# EAGLE design Decoder (EAGLE 9.6.2)
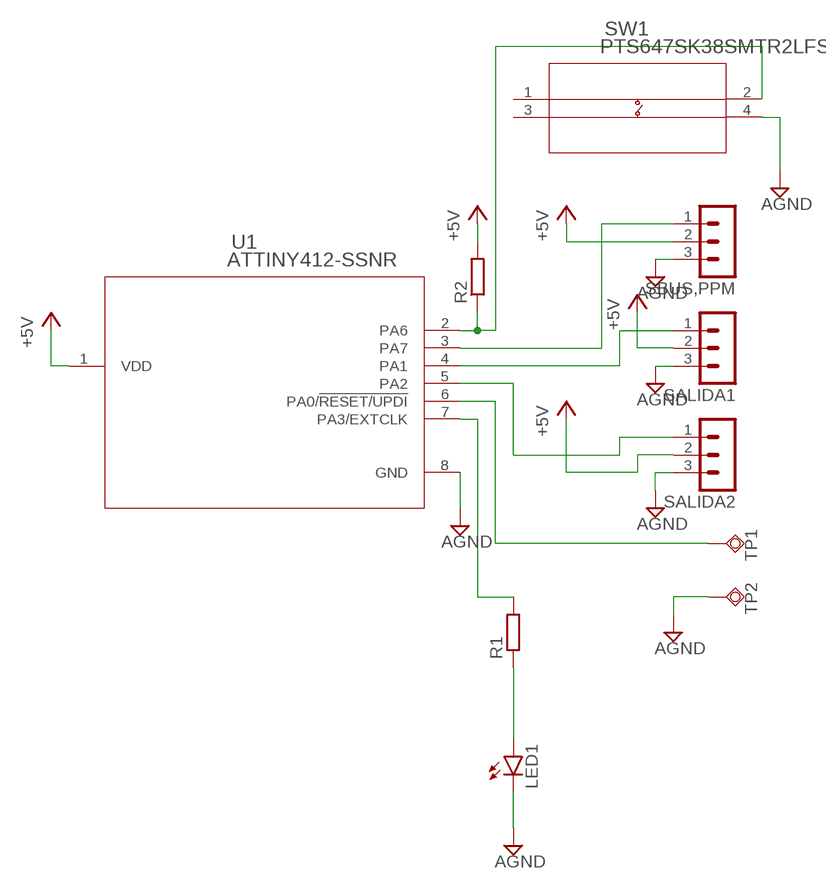
[diagram p0: schematic, sheet 1]

## Parts
LED1  LEDCHIPLED_0603  [CHIPLED_0603]
R1  R-EU_R0805  [R0805]
R2  R-EU_R0805  [R0805]
SALIDA1  MA03-1  [MA03-1]
SALIDA2  MA03-1  [MA03-1]
SBUS,PPM  MA03-1  [MA03-1]
SW1  PTS647SK38SMTR2LFS  [PTS647SK38SMTR2LFS_CNK]
TP1  TPSQTP13R  [TP13R]
TP2  TPSQTP13R  [TP13R]
U1  ATTINY412-SSNR  [SOIC8_SA_SST_MCH]

## Nets
+5V: R2.2 SALIDA1.2 SALIDA2.2 SBUS,PPM.2 U1.1(VDD)
AGND: LED1.C SALIDA1.3 SALIDA2.3 SBUS,PPM.3 SW1.4 TP2.TP U1.8(GND)
N$1: TP1.TP U1.6(PA0/!RESET/UPDI)
N$2: SBUS,PPM.1 U1.3(PA7)
N$3: SALIDA1.1 U1.4(PA1)
N$4: SALIDA2.1 U1.5(PA2)
N$5: R1.2 U1.7(PA3/EXTCLK)
N$6: R2.1 SW1.2 U1.2(PA6)
N$7: LED1.A R1.1
Unconnected: SW1.1 SW1.3

## Library data of the parts
LED1 = led:LED: LED OSRAM: - CHIPLED LG R971, LG N971, LY N971, LG Q971, LY Q971, LO R971, LY R971 LH N974, LH R974 LS Q976, LO Q976, LY Q976 LO Q996 - Hyper CHIPLED LW Q18S LB Q993, LB Q99A, LB R99A - SideLED LS A670, LO A670, LY A670, LG A670, LP A670 LB A673, LV A673, LT A673, LW A673 LH A674 LY A675 LS A676, LA A676, LO A676, LY A676, LW A676 LS A679, LY A679, LG A679 - Hyper Micro SIDELED® LS Y876, LA Y876, LO Y876, LY Y876 LT Y87S - SmartLED LW L88C, LW L88S LB L89C, LB L89S, LG L890 LS L89K, LO L89K, LY L89K LS L896, LA L896, LO L896, LY L896 - TOPLED LS T670, LO T670, LY T670, LG T670, LP T670 LSG T670, LSP T670, LSY T670, LOP T670, LYG T670 LG T671, LOG T671, LSG T671 LB T673, LV T673, LT T673, LW T673 LH T674 LS T676, LA T676, LO T676, LY T676, LB T676, LH T676, LSB T676, LW T676 LB T67C, LV T67C, LT T67C, LS T67K, LO T67K, LY T67K, LW E67C LS E67B, LA E67B, LO E67B, LY E67B, LB E67C, LV E67C, LT E67C LW T67C LS T679, LY T679, LG T679 LS T770, LO T770, LY T770, LG T770, LP T770 LB T773, LV T773, LT T773, LW T773 LH T774 LS E675, LA E675, LY E675, LS T675 LS T776, LA T776, LO T776, LY T776, LB T776 LHGB T686 LT T68C, LB T68C - Hyper Mini TOPLED® LB M676 - Mini TOPLED Santana® LG M470 LS M47K, LO M47K, LY M47K Source: http://www.osram.convergy.de LUXEON: - LUMILED® LXK2-PW12-R00, LXK2-PW12-S00, LXK2-PW14-U00, LXK2-PW14-V00 LXK2-PM12-R00, LXK2-PM12-S00, LXK2-PM14-U00 LXK2-PE12-Q00, LXK2-PE12-R00, LXK2-PE12-S00, LXK2-PE14-T00, LXK2-PE14-U00 LXK2-PB12-K00, LXK2-PB12-L00, LXK2-PB12-M00, LXK2-PB14-N00, LXK2-PB14-P00, LXK2-PB14-Q00 LXK2-PR12-L00, LXK2-PR12-M00, LXK2-PR14-Q00, LXK2-PR14-R00 LXK2-PD12-Q00, LXK2-PD12-R00, LXK2-PD12-S00 LXK2-PH12-R00, LXK2-PH12-S00 LXK2-PL12-P00, LXK2-PL12-Q00, LXK2-PL12-R00 Source: www.luxeon.com KINGBRIGHT: KA-3528ASYC Source: www.kingbright.com
R1 R2 = rcl:R-EU_: RESISTOR, European symbol; SPICEPREFIX: R
SALIDA1 SALIDA2 SBUS,PPM = con-lstb:MA03-1: PIN HEADER; OC_FARNELL: unknown; OC_NEWARK: unknown
SW1 = Push smd:PTS647SK38SMTR2LFS; BUILT_BY: EMA_Cory; COPYRIGHT: Copyright (C) 2018 Accelerated Designs. All rights reserved; DATASHEET: https://www.ckswitches.com/media/2567/pts647.pdf; MANUFACTURER_PART_NUMBER: PTS647SK38SMTR2LFS; SOURCELIBRARY: C&K_2020-05-06; VENDOR: C&K
TP1 TP2 = testpad:TPSQ: Test pad
U1 = Attiny412-serie-tiny-0:ATTINY412-SSNR; BUILT_BY: EMA_Molly; COPYRIGHT: Copyright (C) 2018 Accelerated Designs. All rights reserved; MANUFACTURER_PART_NUMBER: ATTINY412-SSNR; SOURCELIBRARY: Microchip_2019-08-23_25; VENDOR: Microchip

## Board
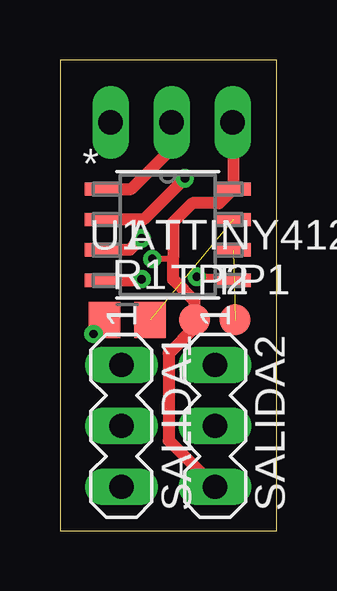
[diagram p1: board, top side]
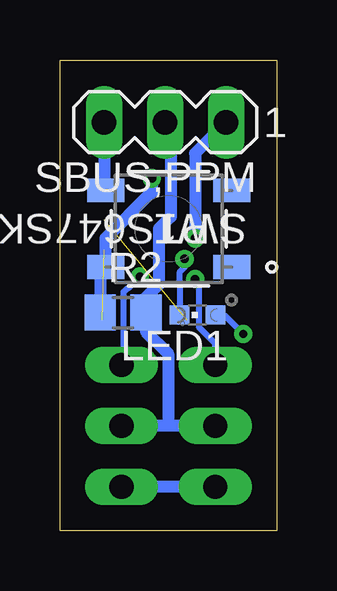
[diagram p2: board, bottom side, seen from below]

Size 9.03 x 19.64 mm. Coordinates in mm from the lower left corner, seen from the top.
Outline: 0,0 9.03,0 9.03,19.64 0,19.64 0,0
Copper layers (1*16): Top 0.035mm / dielectric 1.5mm / Bottom 0.035mm
Design rules "default": minimum track width 6mil, minimum drill 0.35mm, track to track 6mil, track to pad 6mil, pad to pad 6mil, via to via 6mil, smd to smd 6mil, copper to edge 40mil, drill to drill 6mil, minimum pad ring 10mil, minimum via ring 8mil, stop-mask expansion 4mil, vias tented up to drill 0mil, thermal gap 10mil

### Footprints (pad centres in the part's own frame; a part is rotated, then mirrored left to right if it is on the bottom)
CHIPLED_0603 = smd 0.8 x 0.8: A 0,-0.75; C 0,0.75
R0805 = smd 1.3 x 1.5: 1 -0.95,0; 2 0.95,0
MA03-1 = drill 1.016 long: 1 -2.54,0; 2 0,0; 3 2.54,0
PTS647SK38SMTR2LFS_CNK = smd 1.549 x 0.991: 1 -2.625,1.6; 2 2.625,1.6; 3 -2.625,-1.6; 4 2.625,-1.6
TP13R = smd 1.3 x 1.3: TP 0,0
SOIC8_SA_SST_MCH = smd 1.46 x 0.559: 1 -2.724,1.905; 2 -2.724,0.635; 3 -2.724,-0.635; 4 -2.724,-1.905; 5 2.724,-1.905; 6 2.724,-0.635; 7 2.724,0.635; 8 2.724,1.905

### Placement (x,y rotation side)
LED1  3.3,9 90 bottom
R1  2.8,8.8 0 top
R2  6.4,9.1 0 bottom
SALIDA1  2.56,4.38 270 top
SALIDA2  6.46,4.38 270 top
SBUS,PPM  4.65,17.04 180 bottom
SW1  4.5,12.6 180 bottom
TP1  7.3,8.8 0 top
TP2  5.6,8.8 0 top
U1  4.49,12.35 0 top

### Tracks (layer width: path | path; a pad name or v marks a point on that pad's centre or on a via)
+5V
  Top 0.508: U1.1 2.97,14.26 4.65,15.94 SBUS,PPM.2
  Bottom 0.508: SALIDA1.2 4.5,4.38 | 4.5,4.38 SALIDA2.2 | 4.5,4.38 4.53,4.41 4.53,7.4 5.45,8.32 R2.2 5.45,9.74 4.92,10.28 4.92,12.6 4.42,13.1 4.42,16.8 SBUS,PPM.2
AGND  (via drill 0.35)
  Top 0.254: TP2.TP 5.6,8.6 5.6,8.29 | 4.71,11.4 4.66,11.34 v3.84,11.34
  Top 0.508: SBUS,PPM.3 7.21,17.02 U1.8 6.63,13.67 5.52,13.67 4.71,12.87 4.71,11.4 4.71,10.47 5.6,9.59 5.6,8.6 | TP2.TP 5.6,8.47 4.53,7.4 4.53,3.77 SALIDA2.3
  Bottom 0.254: v3.84,11.34 3.84,10.99 4.06,10.77 4.06,10.23 4.05,10.22 LED1.C
  Bottom 0.508: SALIDA1.3 SALIDA2.3 | SBUS,PPM.3 7.19,14.27 SW1.4
N$1  (1 unrouted)
N$2  (via drill 0.35)
  Top 0.508: v3.4,12.2 2.92,11.71 U1.3
  Bottom 0.508: SBUS,PPM.1 3.4,15.75 v3.4,12.2
N$3  (via drill 0.35)
  Top 0.508: v3.4,10.5 3.35,10.45 U1.4
  Bottom 0.254: SALIDA1.1 2.56,7.82 3.23,8.48 3.23,9.3 | 3.4,10.43 3.23,10.25 3.23,9.3 | 3.23,9.3
  Bottom 0.508: 3.4,10.43 v3.4,10.5
N$4  (via drill 0.35)
  Top 0.254: v5.7,10.6 7.06,10.6 U1.5
  Bottom 0.254: v5.7,10.6 6.17,10.13 6.22,10.13 6.38,9.97 6.38,7 SALIDA2.1
N$5  (1 unrouted)
N$6  (via drill 0.35)
  Top 0.508: v5.2,14.7 3.48,12.98 U1.2
  Bottom 0.508: v5.2,14.7 5.2,14.12 7.12,12.2 SW1.2 7.35,10.78 R2.1
N$7  (via drill 0.35)
  Top 0.254: v1.39,8.21 1.39,8.34 R1.1
  Bottom 0.254: LED1.A 2.18,9 v1.39,8.21